# Altium schematic sheet CH340S25P-R0.SchDoc
size 228 x 114 mm
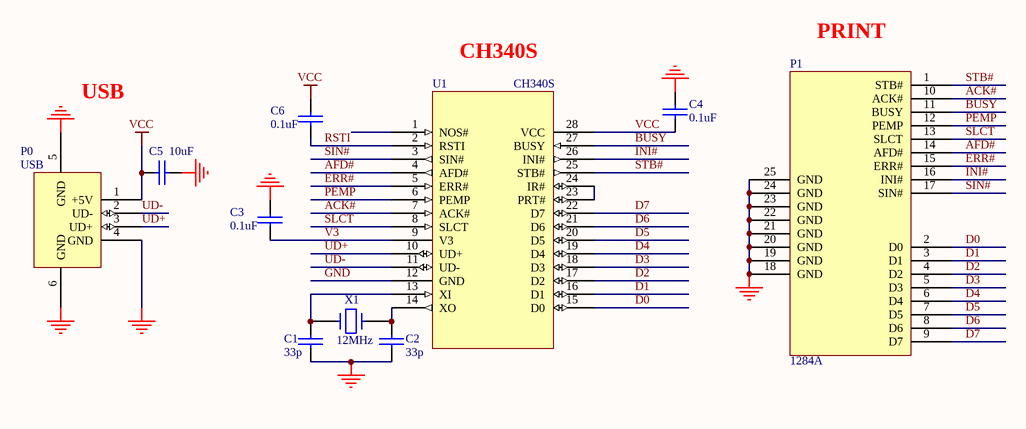
[diagram p0: CH340S25P-R0.SchDoc]

## Parts
C1  33p  [0603]
C2  33p  [0603]
C3  0.1uF  [0603]
C4  0.1uF  [0603]
C5  10uF  [3216]
C6  0.1uF  [0603]
P0  USB  [SIP04]
P1  1284A  [1284A-DB25]
U1  CH340S  [SOP28]
X1  12MHz  [XTAL1]

## Nets
GND: C1.1 C2.1 C3.2 C4.2 C5.2 P0.4(GND) P0.5(GND) P0.6(GND) P1.18(GND) P1.19(GND) P1.20(GND) P1.21(GND) P1.22(GND) P1.23(GND) P1.24(GND) P1.25(GND) U1.12(GND)
VCC: C4.1 C5.1 C6.1 P0.1(+5V) U1.28(VCC)
ACK#: P1.10(ACK#) U1.7(ACK#)
AFD#: P1.14(AFD#) U1.4(AFD#)
BUSY: P1.11(BUSY) U1.27(BUSY)
D0: P1.2(D0) U1.15(D0)
D1: P1.3(D1) U1.16(D1)
D2: P1.4(D2) U1.17(D2)
D3: P1.5(D3) U1.18(D3)
D4: P1.6(D4) U1.19(D4)
D5: P1.7(D5) U1.20(D5)
D6: P1.8(D6) U1.21(D6)
D7: P1.9(D7) U1.22(D7)
ERR#: P1.15(ERR#) U1.5(ERR#)
INI#: P1.16(INI#) U1.26(INI#)
PEMP: P1.12(PEMP) U1.6(PEMP)
RSTI: C6.2 U1.2(RSTI)
SIN#: P1.17(SIN#) U1.3(SIN#)
SLCT: P1.13(SLCT) U1.8(SLCT)
STB#: P1.1(STB#) U1.25(STB#)
UD+: P0.3(UD+) U1.10(UD+)
UD-: P0.2(UD-) U1.11(UD-)
V3: C3.1 U1.9(V3)
NetC1_2: C1.2 U1.13(XI) X1.1
NetC2_2: C2.2 U1.14(XO) X1.2
NetU1_23: U1.23(PRT#) U1.24(IR#)

Not connected (* = marked no-connect by the designer): U1 1(NOS#)

## Notes on the sheet
- (near P1) PRINT
- USB
- CH340S

## Library data of the parts
C1-C3 C6 = CAP
C4 C5 = CAP: Capacitor
U1 = CH340S_P
X1 = CRYSTAL